# Altium schematic sheet 49. POWER INPUT.SchDoc: POWER INPUT
size 513 x 386 mm; Project: PROC154E2(001)_SK_AM69; Issue: 1.0; RevCode: E3; Page Create Date: March  8, 1995; Variant Name: Core Design; Schematic Page Number: 49; Page Number: 49; Page Size: C; Comment: MISTRAL_TITLEBLK_CSIZE_1; Page Count: 62; Schematic Page Count: 62; Name: PROC154E2 001 SK AM69; DsnPath: C:\Users\danie\Downloads\sprr466c\PROC154E3_RP\PROC154E3_SCH.DSN; SchematicName: SCHEMATIC1; PageName: 49. POWER INPUT; PageSize: C; TopSchematic: True
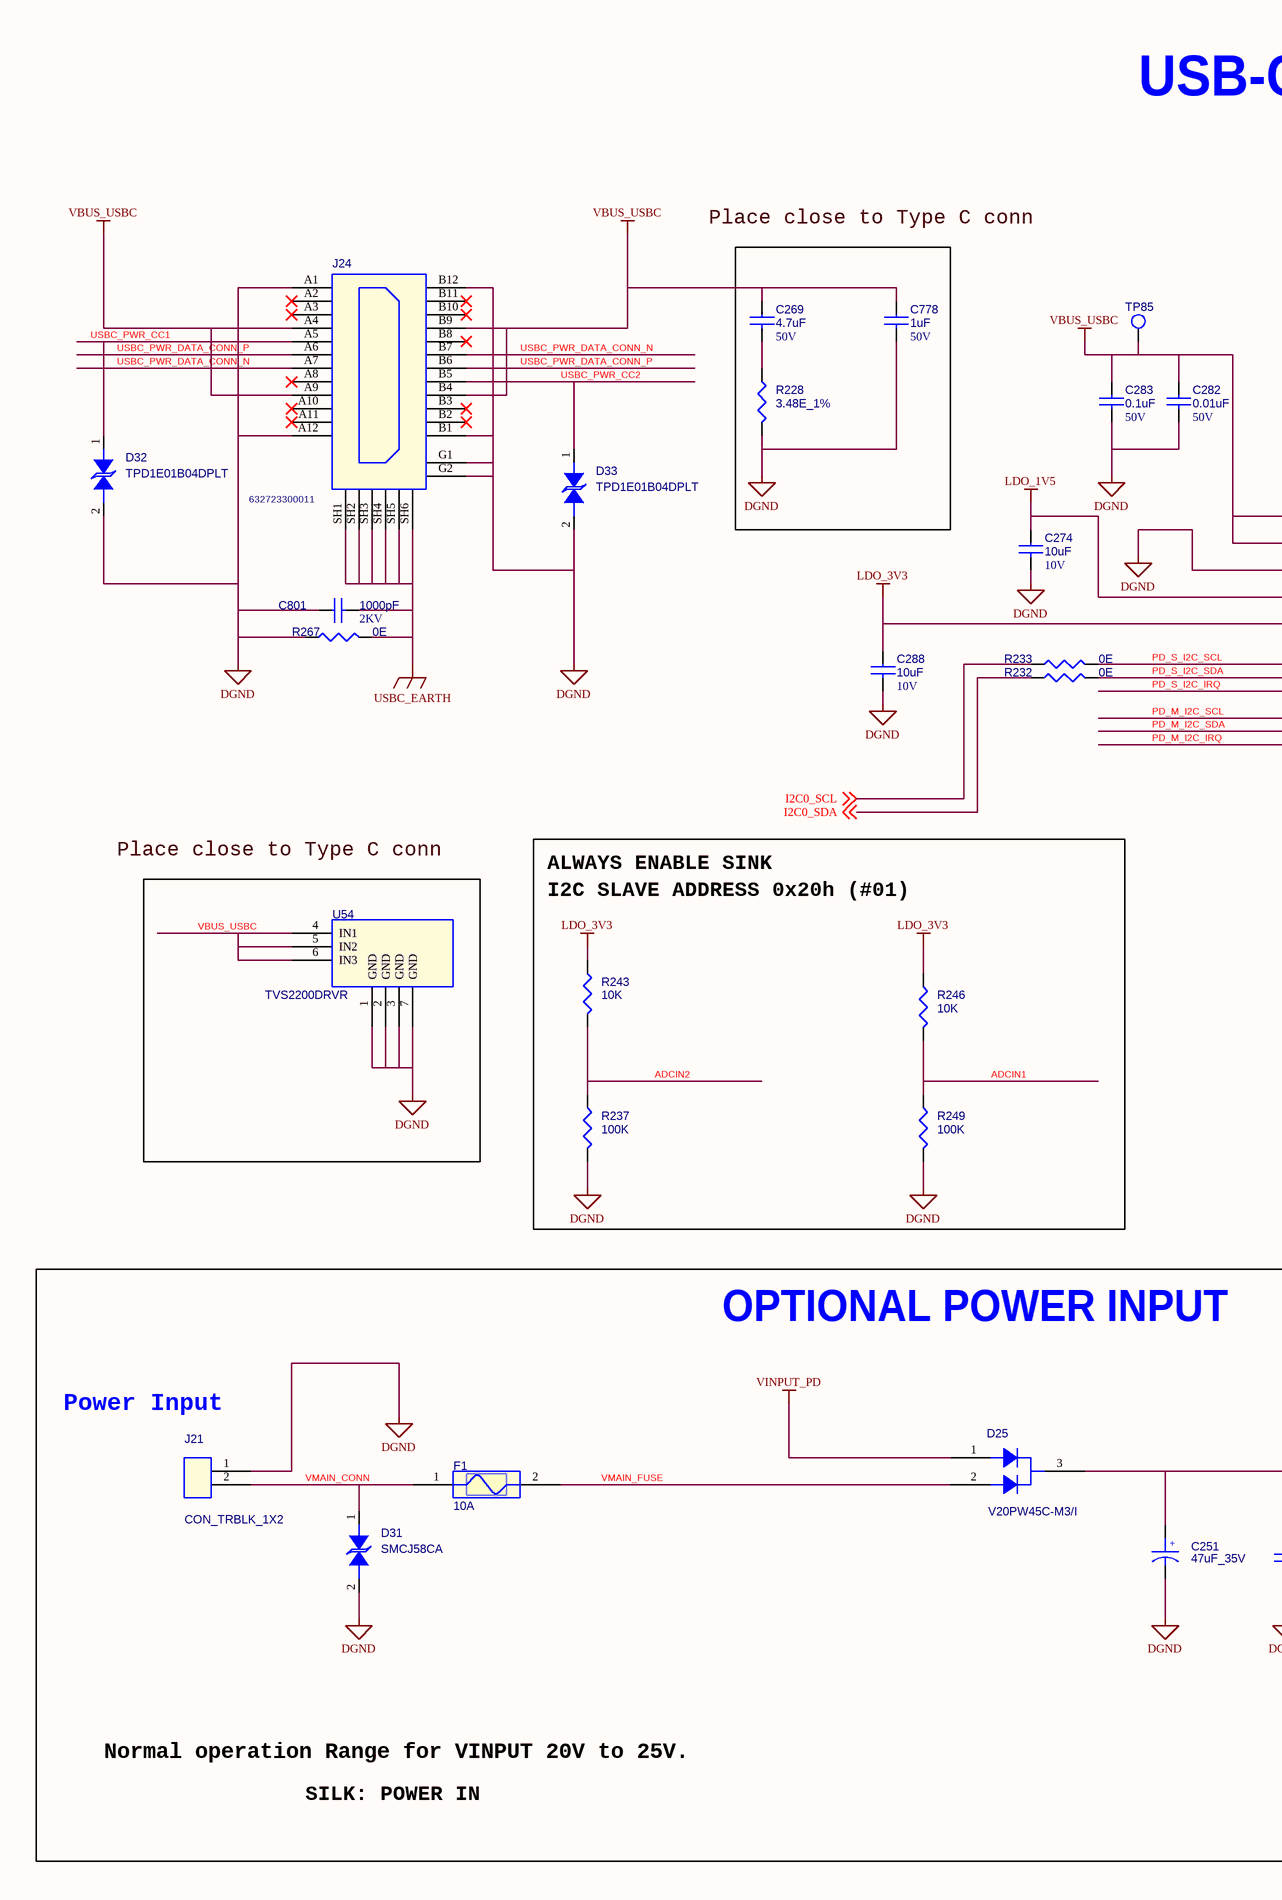
[diagram p0: 49. POWER INPUT.SchDoc, left]
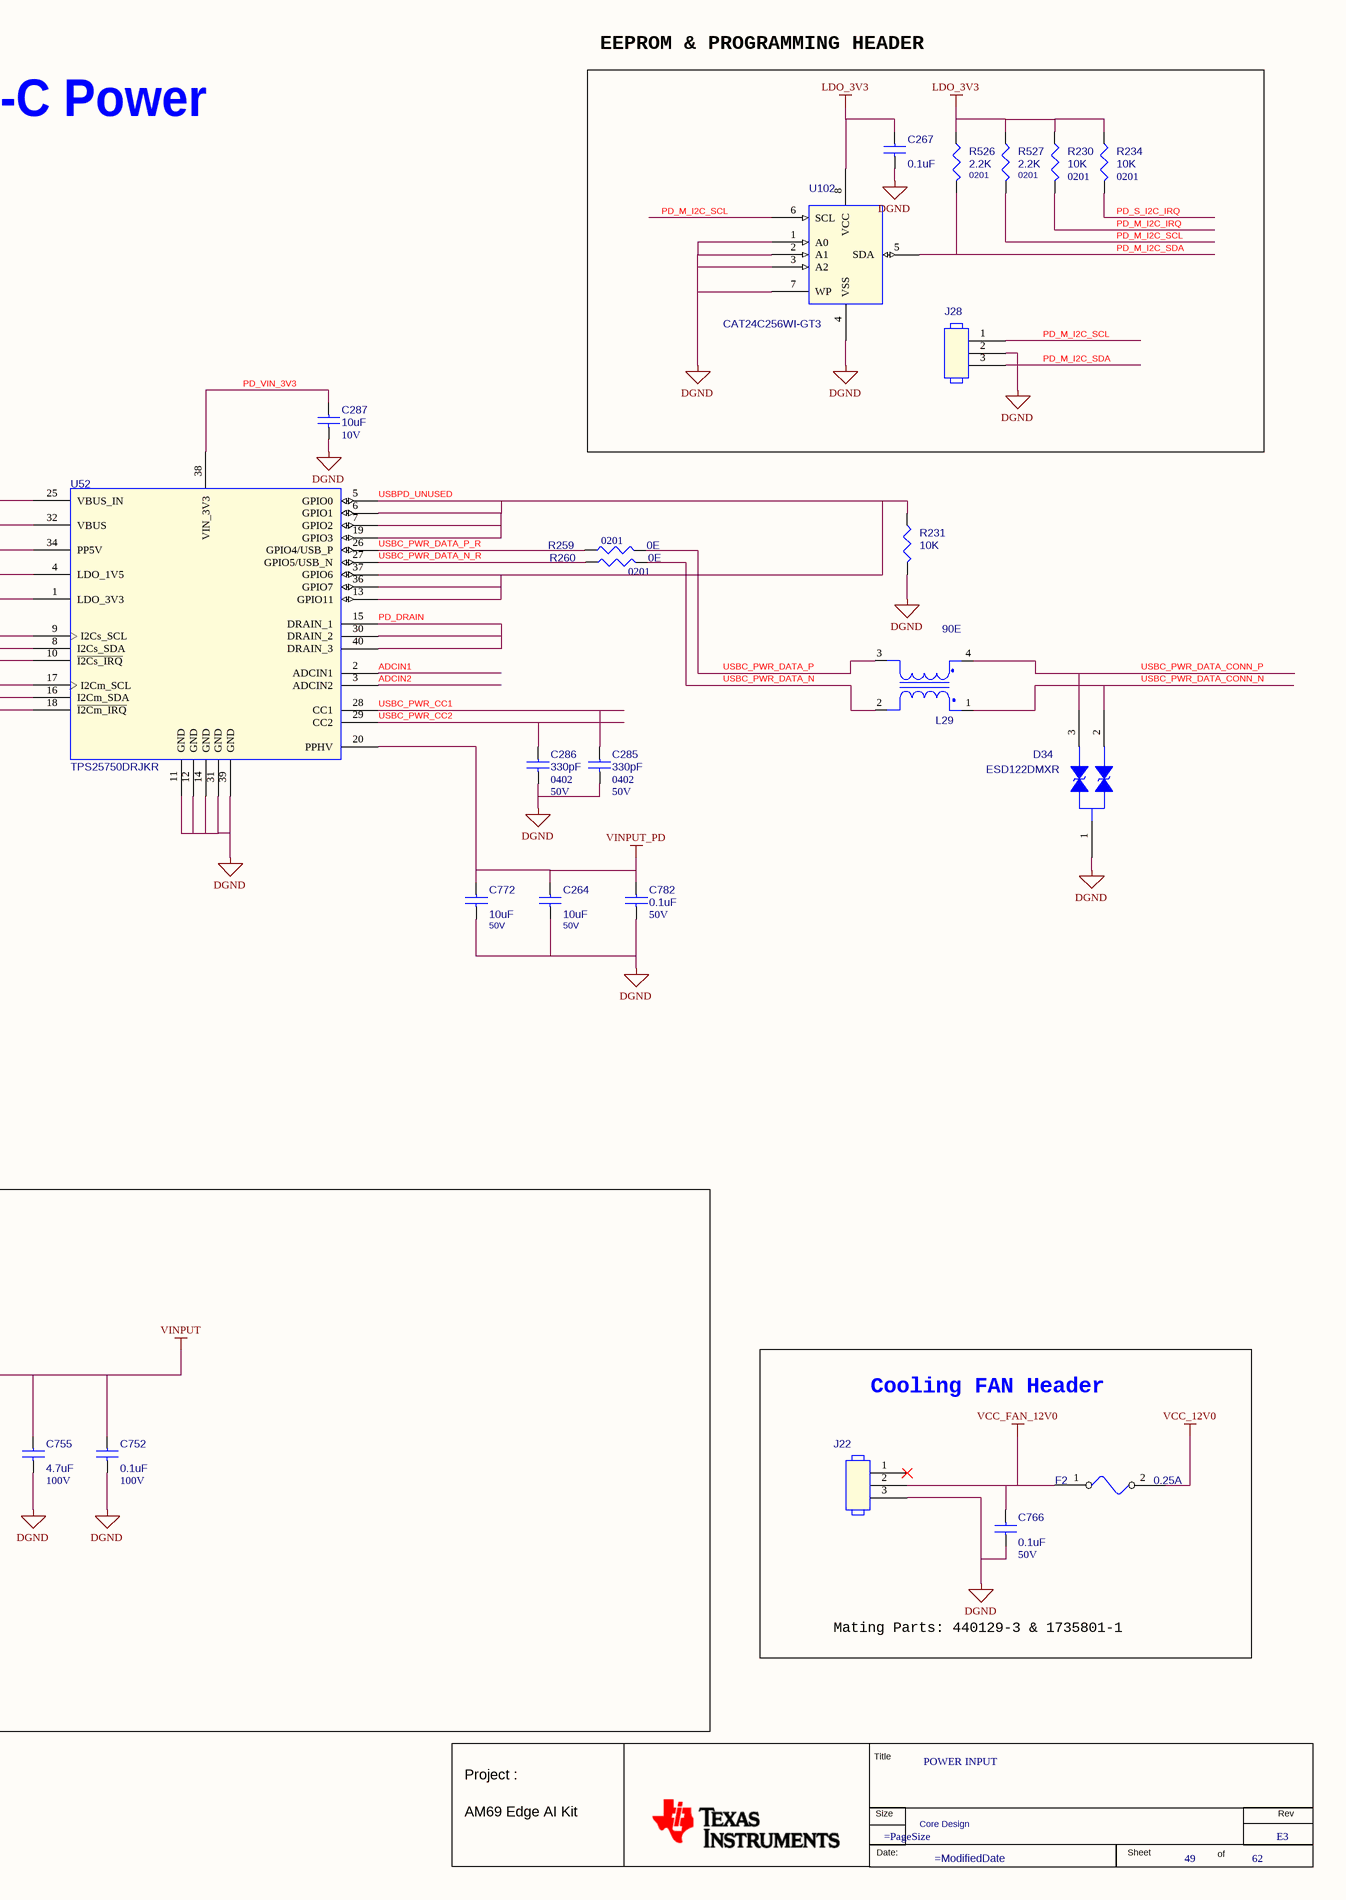
[diagram p1: 49. POWER INPUT.SchDoc, right]

## Parts
*  RevCode: E3  Title: POWER INPUT  Page Number: 49  Page Count: 62  Variant Name: Core Design  (hidden comment: MISTRAL_TITLEBLK_CSIZE_1)  (graphical)
C251  47uF_35V  [CAPT7343E_4-5]
C264  10uF  Voltage: 50V  [CAP1206_2]
C267  0.1uF  [CAP0201_0-5]
C269  4.7uF  Voltage: 50V  [CAP0805_1-5]
C274  10uF  Voltage: 10V  [CAP0402_1]
C282  0.01uF  Voltage: 50V  [CAP0402_0-75]
C283  0.1uF  Voltage: 50V  [CAP0402_0-75]
C285  330pF  Package: 0402  Voltage: 50V  [CAP0402_0-75]
C286  330pF  Voltage: 50V  Package: 0402  [CAP0402_0-75]
C287  10uF  Voltage: 10V  [CAP0402_1]
C288  10uF  Voltage: 10V  [CAP0402_1]
C752  0.1uF  Voltage: 100V  [CAP0603_1]
C755  4.7uF  Voltage: 100V  [CAP1210_2-25]
C766  0.1uF  Voltage: 50V  [CAP0402_0-75]
C772  10uF  Voltage: 50V  [CAP1206_2]
C778  1uF  Voltage: 50V  [CAP0805_1-5]
C782  0.1uF  Voltage: 50V  [CAP0402_0-75]
C801  1000pF  Voltage: 2KV  [CAP1206_1-5]
D25  V20PW45C-M3/I  [TO-252AE-3_V20PW45C_1-6]
D31  SMCJ58CA  [DIO_SMC_2-7]
D32  TPD1E01B04DPLT  [DIO_DFN0201_0-4]
D33  TPD1E01B04DPLT  [DIO_DFN0201_0-4]
D34  ESD122DMXR  [X2SON3_ESD122DMX_30X40_0-4]
F1  10A  [FUSEH_154004_380X200_SMD_3-9]
F2  0.25A  [FUSE_1206_0-8]
J21  CON_TRBLK_1X2  [CON_TB1X2_1803277_P_R_T_7-3]
J22  HDR_1X3  [HDR_1X3_440054-3_S_T_6-4]  (value not drawn)
J24  Mfr_part_number: 632723300011  [CON_USBC24_6327233_S_R_S_3-1]  (hidden comment: CON_USB-C_24_F)
J28  HDR_1X3  [HDR_1X3_100_S_T]  (value not drawn)
L29  90E  [IND4_DLW21H_90X60_SMD_1-4]
R228  3.48E_1%  [RES0402_0-5]
R230  10K  Package: 0201  [RES0201_0-5]
R231  10K  [RES0402_0-5]
R232  0E  [RES0402_0-5]
R233  0E  [RES0402_0-5]
R234  10K  Package: 0201  [RES0201_0-5]
R237  100K  [RES0402_0-5]
R243  10K  [RES0402_0-5]
R246  10K  [RES0402_0-5]
R249  100K  [RES0402_0-5]
R259  0E  Package: 0201  [RES0201_0-5]
R260  0E  Package: 0201  [RES0201_0-5]
R267  0E  [RES0805_0-75]
R526  2.2K  Package: 0201  [RES0201_0-5]
R527  2.2K  Package: 0201  [RES0201_0-5]
TP85  TP30_SMD  [TP30_SMD]  (value not drawn)
U52  TPS25750DRJKR  [WQFN38_TPS25750_240X160_0-8]
U54  TVS2200DRVR  [SON6_25-59_85X85_0-8]
U102  CAT24C256WI-GT3  [SOIC8_1-8]

## Blocks framed on the sheet
EEPROM & PROGRAMMING HEADER: C267 J28 R230 R234 R526 R527 U102
OPTIONAL POWER INPUT: C251 C752 C755 D25 D31 F1 J21
Cooling FAN Header: C766 F2 J22

## Nets
DGND: C251.2 C264.2 C267.2 C274.2 C282.2 C283.2 C285.2 C286.2 C287.2 C288.2 C752.2 C755.2 C766.1 C772.2 C778.2 C782.2 C801.1 D31.2(ANODE) D32.2(ANODE) D33.2(ANODE) D34.1(GND) J21.1 J22.3 J24.A1(GND) J24.A12(GND) J24.B1(GND) J24.B12(GND) J24.G1(GND) J24.G2(GND) J28.2 R228.2 R231.2 R237.2 R249.2 R267.1 U52.11(GND) U52.12(GND) U52.14(GND) U52.31(GND) U52.34(PP5V) U52.39(GND) U54.1(GND) U54.2(GND) U54.3(GND) U54.7(GND) U102.1(A0) U102.2(A1) U102.3(A2) U102.4(VSS) U102.7(WP)
LDO_1V5: C274.1 U52.4(LDO_1V5)
LDO_3V3: C267.1 C288.1 R230.1 R234.1 R243.1 R246.1 R526.1 R527.1 U52.1(LDO_3V3) U102.8(VCC)
USBC_EARTH: C801.2 J24.SH1 J24.SH2 J24.SH3 J24.SH4 J24.SH5 J24.SH6 R267.2
VBUS_USBC: C269.1 C282.1 C283.1 C778.1 J24.A4(VBUS1) J24.A9(VBUS2) J24.B4(VBUS3) J24.B9(VBUS4) TP85.1(TP) U52.25(VBUS_IN) U52.32(VBUS) U54.4(IN1) U54.5(IN2) U54.6(IN3)
VCC_12V0: F2.2
VCC_FAN_12V0: C766.2 F2.1 J22.2
VINPUT: C251.1 C752.1 C755.1 D25.3(K)
VINPUT_PD: C264.1 C772.1 C782.1 D25.1 U52.20(PPHV)
ADCIN1: R246.2 R249.1 U52.2(ADCIN1)
ADCIN2: R237.1 R243.2 U52.3(ADCIN2)
I2C0_SCL: R233.1 ; off-sheet I2C0_SCL
I2C0_SDA: R232.1 ; off-sheet I2C0_SDA
PD_DRAIN: U52.15(DRAIN_1) U52.30(DRAIN_2) U52.40(DRAIN_3)
PD_M_I2C_IRQ: R230.2 U52.18(~{I2Cm_IRQ})
PD_M_I2C_SCL: J28.1 R527.2 U52.17(I2Cm_SCL) U102.6(SCL)
PD_M_I2C_SDA: J28.3 R526.2 U52.16(I2Cm_SDA) U102.5(SDA)
PD_S_I2C_IRQ: R234.2 U52.10(~{I2Cs_IRQ})
PD_S_I2C_SCL: R233.2 U52.9(I2Cs_SCL)
PD_S_I2C_SDA: R232.2 U52.8(I2Cs_SDA)
PD_VIN_3V3: C287.1 U52.38(VIN_3V3)
USBC_PWR_CC1: C285.1 D32.1(CATHODE) J24.A5(CC1) U52.28(CC1)
USBC_PWR_CC2: C286.1 D33.1(CATHODE) J24.B5(CC2) U52.29(CC2)
USBC_PWR_DATA_CONN_N: D34.2(IO1) J24.A7(DN1) J24.B7(DN2) L29.1(IN1)
USBC_PWR_DATA_CONN_P: D34.3(IO2) J24.A6(DP1) J24.B6(DP2) L29.4(OUT2)
USBC_PWR_DATA_N: L29.2(IN2) R260.2
USBC_PWR_DATA_N_R: R260.1 U52.27(GPIO5/USB_N)
USBC_PWR_DATA_P: L29.3(OUT1) R259.2
USBC_PWR_DATA_P_R: R259.1 U52.26(GPIO4/USB_P)
USBPD_UNUSED: R231.1 U52.5(GPIO0) U52.6(GPIO1) U52.7(GPIO2) U52.13(GPIO11) U52.19(GPIO3) U52.36(GPIO7) U52.37(GPIO6)
VMAIN_CONN: D31.1(CATHODE) F1.1 J21.2
VMAIN_FUSE: D25.2 F1.2
NetC269_2: C269.2 R228.1

Not connected (* = marked no-connect by the designer): J22 1*; J24 A2(SSTXP1)* A3(SSTXN1)* A8(SBU1)* A10(SSRXN2)* A11(SSRXP2)* B2(SSTXP2)* B3(SSTXN2)* B8(SBU2)* B10(SSRXN1)* B11(SSRXP1)*

## Notes on the sheet
- USB-C Power
- Place close to Type C conn
- ALWAYS ENABLE SINK
- I2C SLAVE ADDRESS 0x20h (#01)
- Power Input
- Normal operation Range for VINPUT 20V to 25V.
- SILK: POWER IN
- Mating Parts: 440129-3 & 1735801-1
- (in symbol CAP_POL) +
- (in symbol MISTRAL_TITLEBLK_CSIZE_1) Title; Project :; Size; Rev; AM69 Edge AI Kit; Date:; Sheet; of

## Library data of the parts
* = MISTRAL_TITLEBLK_CSIZE_1: Issue: 1.0; Project: PROC154E2(001)_SK_AM69; Name: PROC154E2 001 SK AM69; Page Create Date: March  8, 1995; Page Size: =PageSize; Page Modify Date: =ModifiedDate; Schematic Page Count: 62; Schematic Page Number: 49
C251 = CAP_POL: CAP TANTALUM 47uF 35V 20% ESR 0.9E E7343; Part Reference: C251; Mistral Part No: 120009030743-R; Mfr_name: AVX CORPORATION; Mfr_part_number: TAJE476M035R; Part_type: CAPACITORS\TANTALUM; Project: LTS; Wattage: NA; Customs_HS_Code: 85322990; Custom_Duty: 15%; Value: 47uF_35V; PCB Footprint: CAPT7343E_4-5; Footprint Ref: CAPT7343E_4-5; Tolerance: 20%; Voltage: 35V; Package: E7343; Distributor_name: DIGIKEY; Distributor_part_number: 478-3958-1-ND; Library Ref: CAP_POL; Height: 4.30MM; Weight: 670mg; Temperature: -55°C+125°C; Datasheet: Y:\MIS_DATABASE\DATASHEETS\CAPACITORS\AVX-TAJ-SER.PDF; Crtd /date: MAZHAR/211206; Chkd/date: SHREESHAIL/300507; MECHANICAL 3D STEP FILE: CAPT7343E_4-5; Library Path: Y:\MIS_DATABASE\Library\ALTIUM_TOOL\SCHEMATICS_PARTS\MS_DISCRETE_Library.schlib; Footprint Path: Y:\MIS_DATABASE\Library\ALTIUM_TOOL\PCB_FOOTPRINTS\Altium_Footprint_Lib.PcbLib
C264 = CAP_Dup1: CAP CERAMIC 10uF 50V 10% X5R AUTO 1206; Part Reference: C264; Part_type: CAPACITORS\CERAMIC; Mfr_part_number: GRT31CR61H106KE01L; Mfr_name: MURATA; Mistral Part No: 120011060019-R; Custom_Duty: 15%; Customs_HS_Code: 85322990; Wattage: NA; Project: LRDE_ABCMV2_MB; Value: 10uF; Footprint Path: Y:\MIS_DATABASE\Library\ALTIUM_TOOL\PCB_FOOTPRINTS\Altium_Footprint_Lib.PcbLib; Library Path: Y:\MIS_DATABASE\Library\ALTIUM_TOOL\SCHEMATICS_PARTS\MS_DISCRETE_Library.schlib; MECHANICAL 3D STEP FILE: CAP1206_2; Chkd/date: MANIRAJA/261018; Crtd /date: ALVY/261018; Datasheet: Y:\MIS_DATABASE\DATASHEETS\CAPACITORS\GRT31CR61H106KE01L.PDF; Temperature: -55°C+85°C; Weight: 16.2mg; Height: 1.80MM; Library Ref: CAP; Distributor_part_number: 490-12456-1-ND; Distributor_name: DIGIKEY; Package: 1206; Tolerance: 10%; Footprint Ref: CAP1206_2; PCB Footprint: CAP1206_2
C267 = CAP_Dup1: CAP CERAMIC 0.1uF 16V 10% X7S AUTO 0201; Part Reference: C267; Mistral Part No: 120021030007-R; Mfr_name: MURATA; Mfr_part_number: GRT033C71C104KE01D; Part_type: CAPACITORS\CERAMIC; Project: J7ES_SK_BRD; Wattage: NA; Customs_HS_Code: 85322990; Custom_Duty: 15%; Value: 0.1uF; PCB Footprint: CAP0201_0-5; Tolerance: 10%; Voltage: 16V; Package: 0201; Distributor_name: DIGIKEY; Distributor_part_number: 490-GRT033C71C104KE01DTR-ND; Height: 0.33MM; Weight: 330mg; Temperature: -55°C+125°C; Datasheet: Y:\MIS_DATABASE\DATASHEETS\CAPACITORS\GRT033C71C104KE01.PDF; Crtd /date: ALVY/110321; Chkd/date: MANIRAJA/110321; MECHANICAL 3D STEP FILE: CAP0201_0-5
C269 = CAP_Dup1: CAP CERAMIC 4.7uF 50V 10% X5R AUTO 0805; Part Reference: C269; Mistral Part No: 120021020034-R; Mfr_name: MURATA; Mfr_part_number: GRT21BR61H475KE13L; Part_type: CAPACITORS\CERAMIC; Project: TI_DRA821 SK EVM BRD; Wattage: NA; Customs_HS_Code: 85322990; Custom_Duty: 15%; Value: 4.7uF; Footprint Ref: CAP0805_1-5; Tolerance: 10%; Package: 0805; Distributor_name: DIGIKEY; Distributor_part_number: 490-12394-1-ND; Library Ref: CAP; Height: 1.40MM; Weight: 5.5mg; Temperature: -55°C+85°C; Datasheet: Y:\MIS_DATABASE\DATASHEETS\CAPACITORS\GRT21BR61H475KE13.PDF; Crtd /date: ALVY/240221; Chkd/date: MANIRAJA/250221; MECHANICAL 3D STEP FILE: CAP0805_1-5; Library Path: Y:\MIS_DATABASE\Library\ALTIUM_TOOL\SCHEMATICS_PARTS\MS_DISCRETE_Library.schlib; Footprint Path: Y:\MIS_DATABASE\Library\ALTIUM_TOOL\PCB_FOOTPRINTS\Altium_Footprint_Lib.PcbLib; PCB Footprint: CAP0805_1-5
C274 = CAP_Dup1: CAP CERAMIC 10uF 10V 20% X5R 0402; Part Reference: C274; Part_type: CAPACITORS\CERAMIC; Mfr_part_number: CL05A106MP8NUB8; Mfr_name: SAMSUNG; Mistral Part No: 120019020008-R; Wattage: NA; Custom_Duty: 15%; Customs_HS_Code: 85322990; Project: TI_60GHz-AOP; Value: 10uF; MECHANICAL 3D STEP FILE: CAP0402_1; Temperature: -55°C+85°C; Weight: NA; Chkd/date: MANIRAJA/150219; Crtd /date: ALVY/150219; Datasheet: Y:\MIS_DATABASE\DATASHEETS\CAPACITORS\CL05A106MP8NUB8.PDF; Height: 0.90MM; Library Ref: CAP; Distributor_part_number: 1276-6830-1-ND; Distributor_name: DIGIKEY; Package: 0402; Tolerance: 20%; Footprint Ref: CAP0402_1; Library Path: Y:\MIS_DATABASE\Library\ALTIUM_TOOL\SCHEMATICS_PARTS\MS_DISCRETE_Library.schlib; Footprint Path: Y:\MIS_DATABASE\Library\ALTIUM_TOOL\PCB_FOOTPRINTS\Altium_Footprint_Lib.PcbLib; PCB Footprint: CAP0402_1
C282 = CAP_Dup1: CAP CERAMIC 0.01uF 50V 10% X7R AUTO 0402; Part Reference: C282; Mistral Part No: 120019040011-R; Mfr_name: MURATA; Mfr_part_number: GRT155R71H103KE01D; Part_type: CAPACITORS\CERAMIC; Project: TI_DRA821 SK EVM BRD; Wattage: NA; Customs_HS_Code: 85322990; Custom_Duty: 15%; Value: 0.01uF; Footprint Ref: CAP0402_0-75; Tolerance: 10%; Package: 0402; Distributor_name: MOUSER; Distributor_part_number: 81-GRT155R71H103KE1D; Library Ref: CAP; Height: 0.55MM; Weight: 1.6mg; Temperature: -55°C+125°C; Datasheet: Y:\MIS_DATABASE\DATASHEETS\CAPACITORS\GRT155R71H103KE01.PDF; Crtd /date: ALVY/240221; Chkd/date: MANIRAJA/250221; MECHANICAL 3D STEP FILE: CAP0402_0-75; Library Path: Y:\MIS_DATABASE\Library\ALTIUM_TOOL\SCHEMATICS_PARTS\MS_DISCRETE_Library.schlib; Footprint Path: Y:\MIS_DATABASE\Library\ALTIUM_TOOL\PCB_FOOTPRINTS\Altium_Footprint_Lib.PcbLib; PCB Footprint: CAP0402_0-75
C283 = CAP_Dup1: CAP CERAMIC 0.1uF 50V 10% X7R AUTO 0402; Part Reference: C283; Part_type: CAPACITORS\CERAMIC; Mfr_part_number: GRT155R71H104KE01D; Mfr_name: MURATA; Mistral Part No: 120019030005-R; Custom_Duty: 15%; Customs_HS_Code: 85322990; Wattage: NA; Project: TI_DRA821 SK EVM BRD; Value: 0.1uF; MECHANICAL 3D STEP FILE: CAP0402_0-75; Footprint Path: Y:\MIS_DATABASE\Library\ALTIUM_TOOL\PCB_FOOTPRINTS\Altium_Footprint_Lib.PcbLib; Library Path: Y:\MIS_DATABASE\Library\ALTIUM_TOOL\SCHEMATICS_PARTS\MS_DISCRETE_Library.schlib; Chkd/date: MANIRAJA/250221; Crtd /date: ALVY/240221; Datasheet: Y:\MIS_DATABASE\DATASHEETS\CAPACITORS\GRT155R71H104KE01.PDF; Temperature: -55°C+125°C; Weight: NA; Height: 0.55MM; Library Ref: CAP; Distributor_part_number: 81-GRT155R71H104KE1D; Distributor_name: MOUSER; Package: 0402; Tolerance: 10%; Footprint Ref: CAP0402_0-75; PCB Footprint: CAP0402_0-75
C285 = CAP_Dup1: CAP CERAMIC 330pF 50V 5% C0G(NP0) AUTO 0402; Part Reference: C285; Part_type: CAPACITORS\CERAMIC; Mfr_part_number: GRT1555C1H331JA02D; Mfr_name: MURATA; Mistral Part No: 120019050019-R; Custom_Duty: 15%; Customs_HS_Code: 85322990; Wattage: NA; Project: TI_DRA821 SK EVM BRD; Value: 330pF; Footprint Path: Y:\MIS_DATABASE\Library\ALTIUM_TOOL\PCB_FOOTPRINTS\Altium_Footprint_Lib.PcbLib; Library Path: Y:\MIS_DATABASE\Library\ALTIUM_TOOL\SCHEMATICS_PARTS\MS_DISCRETE_Library.schlib; MECHANICAL 3D STEP FILE: CAP0402_0-75; Chkd/date: MANIRAJA/250221; Crtd /date: ALVY/240221; Datasheet: Y:\MIS_DATABASE\DATASHEETS\CAPACITORS\GRT1555C1H331JA02.PDF; Temperature: -55°C+125°C; Weight: 3.1mg; Height: 0.55MM; Footprint Ref: CAP0402_0-75; Library Ref: CAP; Distributor_part_number: 81-GRT1555C1H331JA2D; Distributor_name: MOUSER; Tolerance: 5%; PCB Footprint: CAP0402_0-75
C286 = CAP_Dup1: CAP CERAMIC 330pF 50V 5% C0G(NP0) AUTO 0402; Part Reference: C286; Mistral Part No: 120019050019-R; Mfr_name: MURATA; Mfr_part_number: GRT1555C1H331JA02D; Part_type: CAPACITORS\CERAMIC; Project: TI_DRA821 SK EVM BRD; Wattage: NA; Customs_HS_Code: 85322990; Custom_Duty: 15%; Value: 330pF; Tolerance: 5%; Distributor_name: MOUSER; Distributor_part_number: 81-GRT1555C1H331JA2D; Library Ref: CAP; Footprint Ref: CAP0402_0-75; Height: 0.55MM; Weight: 3.1mg; Temperature: -55°C+125°C; Datasheet: Y:\MIS_DATABASE\DATASHEETS\CAPACITORS\GRT1555C1H331JA02.PDF; Crtd /date: ALVY/240221; Chkd/date: MANIRAJA/250221; MECHANICAL 3D STEP FILE: CAP0402_0-75; Library Path: Y:\MIS_DATABASE\Library\ALTIUM_TOOL\SCHEMATICS_PARTS\MS_DISCRETE_Library.schlib; Footprint Path: Y:\MIS_DATABASE\Library\ALTIUM_TOOL\PCB_FOOTPRINTS\Altium_Footprint_Lib.PcbLib; PCB Footprint: CAP0402_0-75
C287 = CAP_Dup1: CAP CERAMIC 10uF 10V 20% X5R 0402; Part Reference: C287; Part_type: CAPACITORS\CERAMIC; Mfr_part_number: CL05A106MP8NUB8; Mfr_name: SAMSUNG; Mistral Part No: 120019020008-R; Custom_Duty: 15%; Customs_HS_Code: 85322990; Wattage: NA; Project: TI_60GHz-AOP; Value: 10uF; MECHANICAL 3D STEP FILE: CAP0402_1; Footprint Path: Y:\MIS_DATABASE\Library\ALTIUM_TOOL\PCB_FOOTPRINTS\Altium_Footprint_Lib.PcbLib; Library Path: Y:\MIS_DATABASE\Library\ALTIUM_TOOL\SCHEMATICS_PARTS\MS_DISCRETE_Library.schlib; Chkd/date: MANIRAJA/150219; Crtd /date: ALVY/150219; Datasheet: Y:\MIS_DATABASE\DATASHEETS\CAPACITORS\CL05A106MP8NUB8.PDF; Temperature: -55°C+85°C; Weight: NA; Height: 0.90MM; Library Ref: CAP; Distributor_part_number: 1276-6830-1-ND; Distributor_name: DIGIKEY; Package: 0402; Tolerance: 20%; Footprint Ref: CAP0402_1; PCB Footprint: CAP0402_1
C288 = CAP_Dup1: CAP CERAMIC 10uF 10V 20% X5R 0402; Part Reference: C288; Mistral Part No: 120019020008-R; Mfr_name: SAMSUNG; Mfr_part_number: CL05A106MP8NUB8; Part_type: CAPACITORS\CERAMIC; Project: TI_60GHz-AOP; Customs_HS_Code: 85322990; Custom_Duty: 15%; Wattage: NA; Value: 10uF; Footprint Path: Y:\MIS_DATABASE\Library\ALTIUM_TOOL\PCB_FOOTPRINTS\Altium_Footprint_Lib.PcbLib; Library Path: Y:\MIS_DATABASE\Library\ALTIUM_TOOL\SCHEMATICS_PARTS\MS_DISCRETE_Library.schlib; Footprint Ref: CAP0402_1; Tolerance: 20%; Package: 0402; Distributor_name: DIGIKEY; Distributor_part_number: 1276-6830-1-ND; Library Ref: CAP; Height: 0.90MM; Datasheet: Y:\MIS_DATABASE\DATASHEETS\CAPACITORS\CL05A106MP8NUB8.PDF; Crtd /date: ALVY/150219; Chkd/date: MANIRAJA/150219; Weight: NA; Temperature: -55°C+85°C; MECHANICAL 3D STEP FILE: CAP0402_1; PCB Footprint: CAP0402_1
C752 = CAP: CAP CERAMIC 0.1uF 100V 10% X7R 0603; Part Reference: C752; Manufacturer: MURATA; Mfr_part_number: GRM188R72A104KA35D; Mistral Part No: 120017010012-R; Mistral part number: NSPN00374; Mfr: YAGEO AMERICA; MfrNum: CC0603KRX7R0BB104; Part_type: CAPACITORS\CERAMIC; Direct Alternate_mfr_name: SAMSUNG; Direct Alternate_mfr_part_number: CL10B104JB8NNNC; Automotive Alternate_mfr_name: TDK; Automotive Alternate_mfr_part_number: CGA3E2X7R1H104K080AA; Custom_Duty: 15%; Customs_HS_Code: 85322990; Wattage: NA; Project: CUSTOM DCA1000; Value: 0.1uF; PCB Footprint: CAP0603_1; Footprint Path: Y:\MIS_DATABASE\Library\ALTIUM_TOOL\PCB_FOOTPRINTS\Altium_Footprint_Lib.PcbLib; Library Path: Y:\MIS_DATABASE\Library\ALTIUM_TOOL\SCHEMATICS_PARTS\MS_DISCRETE_Library.schlib; Footprint Ref: CAP0603_1; Library Ref: CAP; MECHANICAL 3D STEP FILE: CAP0603_1; Chkd/date: MANIRAJA/170420; Datasheet: Y:\MIS_DATABASE\DATASHEETS\CAPACITORS\GRM188R72A104KA35.PDF; Temperature: -55°C+125°C; Weight: 6.3mg; Height: 0.90MM; Distributor_part_number: 490-3285-1-ND; Distributor_name: DIGIKEY; Package: 0603; Tolerance: 10%; Mfr_name: MURATA; DescriptiveText: CAP CERAMIC 0.1uF 100V 10% X7R 0603; Crtd /date: ALVY/170420
C755 = CAP_Dup1: CAP CERAMIC 4.7uF 100V 10% X7S AUTO 1210; Part Reference: C755; Manufacturer: MURATA; Mistral Part No: 120022090024-R; Mfr_part_number: GCM32DC72A475KE02; Part_type: CAPACITORS\CERAMIC; Direct Alternate_mfr_part_number: GRM21BR61H475KE51L; Automotive Alternate_mfr_name: TDK; Automotive Alternate_mfr_part_number: CGA4J1X7R1H475K125AC; Project: J7AHP_SK_BRD; Wattage: NA; Customs_HS_Code: 85322990; Custom_Duty: 15%; Value: 4.7uF; PCB Footprint: CAP1210_2-25; Mfr_name: MURATA; Tolerance: 10%; Package: 1210; Distributor_name: DIGIKEY; Distributor_part_number: 490-GCM32DC72A475KE02KCT-ND; Library Ref: CAP; Height: 2.20MM; Weight: 95mg; Temperature: -55°C+125°C; Datasheet: Y:\MIS_DATABASE\DATASHEETS\CAPACITORS\GCM32DC72A475KE02.PDF; Crtd /date: PRAVEEN/160922; Chkd/date: PRAVEEN/160922; MECHANICAL 3D STEP FILE: CAP1210_2-25; Footprint Ref: CAP1210_2-25; Library Path: Y:\MIS_DATABASE\Library\ALTIUM_TOOL\SCHEMATICS_PARTS\MS_DISCRETE_Library.schlib; Footprint Path: Y:\MIS_DATABASE\Library\ALTIUM_TOOL\PCB_FOOTPRINTS\Altium_Footprint_Lib.PcbLib; Direct Alternate_mfr_name: MURATA
C766 = CAP_Dup1: CAP CERAMIC 0.1uF 50V 10% X7R 0402; Part Reference: C766; Part_type: CAPACITORS\CERAMIC; Mfr_part_number: GRM155R71H104KE14D; Mfr_name: MURATA; Mistral Part No: 120011100014-R; Direct Alternate_mfr_name: TDK; Direct Alternate_mfr_part_number: C1005X7R1H104K050BE; Automotive Alternate_mfr_part_number: CGA2B3X7R1H104K050BB; Custom_Duty: 15%; Customs_HS_Code: 85322990; Wattage: NA; Project: J7_CP; Value: 0.1uF; PCB Footprint: CAP0402_0-75; Footprint Path: Y:\MIS_DATABASE\Library\ALTIUM_TOOL\PCB_FOOTPRINTS\Altium_Footprint_Lib.PcbLib; Library Path: Y:\MIS_DATABASE\Library\ALTIUM_TOOL\SCHEMATICS_PARTS\MS_DISCRETE_Library.schlib; MECHANICAL 3D STEP FILE: CAP0402_0-75; Chkd/date: MANIRAJA/261020; Crtd /date: ALVY/211020; Datasheet: Y:\MIS_DATABASE\DATASHEETS\CAPACITORS\GRM155R71H104KE14.PDF; Temperature: -55°C+125°C; Weight: 3.1mg; Height: 0.55MM; Distributor_part_number: 490-10700-1-ND; Distributor_name: DIGIKEY; Package: 0402; Tolerance: 10%; Library Ref: CAP; Footprint Ref: CAP0402_0-75; Automotive Alternate_mfr_name: TDK; Manufacturer: MURATA
C772 = CAP_Dup1: CAP CERAMIC 10uF 50V 10% X5R AUTO 1206; Part Reference: C772; Direct Alternate_mfr_part_number: C3216X5R1E476M160AC; Direct Alternate_mfr_name: TDK; Part_type: CAPACITORS\CERAMIC; Mfr_part_number: GRT31CR61H106KE01L; Mfr_name: MURATA; Mistral Part No: 120011060019-R; Custom_Duty: 15%; Customs_HS_Code: 85322990; Wattage: NA; Project: LRDE_ABCMV2_MB; Value: 10uF; Footprint Path: Y:\MIS_DATABASE\Library\ALTIUM_TOOL\PCB_FOOTPRINTS\Altium_Footprint_Lib.PcbLib; Library Path: Y:\MIS_DATABASE\Library\ALTIUM_TOOL\SCHEMATICS_PARTS\MS_DISCRETE_Library.schlib; MECHANICAL 3D STEP FILE: CAP1206_2; Chkd/date: MANIRAJA/261018; Crtd /date: ALVY/261018; Datasheet: Y:\MIS_DATABASE\DATASHEETS\CAPACITORS\GRT31CR61H106KE01L.PDF; Temperature: -55°C+85°C; Weight: 16.2mg; Height: 1.80MM; Library Ref: CAP; Distributor_part_number: 490-12456-1-ND; Distributor_name: DIGIKEY; Package: 1206; Tolerance: 10%; Footprint Ref: CAP1206_2; PCB Footprint: CAP1206_2
C778 = CAP_Dup1: CAP CERAMIC 1uF 50V 10% X7R AUTO 0805; Part Reference: C778; Mistral Part No: 120021020035-R; Mfr_name: MURATA; Mfr_part_number: GRT21BR71H105KE01L; Part_type: CAPACITORS\CERAMIC; Project: TI_DRA821 SK EVM BRD; Wattage: NA; Customs_HS_Code: 85322990; Custom_Duty: 15%; Value: 1uF; Footprint Ref: CAP0805_1-5; Tolerance: 10%; Package: 0805; Distributor_name: MOUSER; Distributor_part_number: 81-GRT21BR71H105KE1L; Library Ref: CAP; Height: 1.35MM; Weight: 17mg; Temperature: -55°C+125°C; Datasheet: Y:\MIS_DATABASE\DATASHEETS\CAPACITORS\GRT21BR71H105KE01.PDF; Crtd /date: ALVY/240221; Chkd/date: MANIRAJA/250221; MECHANICAL 3D STEP FILE: CAP0805_1-5; Library Path: Y:\MIS_DATABASE\Library\ALTIUM_TOOL\SCHEMATICS_PARTS\MS_DISCRETE_Library.schlib; Footprint Path: Y:\MIS_DATABASE\Library\ALTIUM_TOOL\PCB_FOOTPRINTS\Altium_Footprint_Lib.PcbLib; PCB Footprint: CAP0805_1-5
C782 = CAP_Dup1: CAP CERAMIC 0.1uF 50V 10% X7R AUTO 0402; Part Reference: C782; Part_type: CAPACITORS\CERAMIC; Mfr_part_number: GRT155R71H104KE01D; Mfr_name: MURATA; Mistral Part No: 120019030005-R; Custom_Duty: 15%; Customs_HS_Code: 85322990; Wattage: NA; Project: TI_DRA821 SK EVM BRD; Value: 0.1uF; MECHANICAL 3D STEP FILE: CAP0402_0-75; Footprint Path: Y:\MIS_DATABASE\Library\ALTIUM_TOOL\PCB_FOOTPRINTS\Altium_Footprint_Lib.PcbLib; Library Path: Y:\MIS_DATABASE\Library\ALTIUM_TOOL\SCHEMATICS_PARTS\MS_DISCRETE_Library.schlib; Chkd/date: MANIRAJA/250221; Crtd /date: ALVY/240221; Datasheet: Y:\MIS_DATABASE\DATASHEETS\CAPACITORS\GRT155R71H104KE01.PDF; Temperature: -55°C+125°C; Weight: NA; Height: 0.55MM; Library Ref: CAP; Distributor_part_number: 81-GRT155R71H104KE1D; Distributor_name: MOUSER; Package: 0402; Tolerance: 10%; Footprint Ref: CAP0402_0-75; PCB Footprint: CAP0402_0-75
C801 = CAP_Dup1: CAP CERAMIC 1000pF 2KV 10% X7R 1206; Part Reference: C801; Mistral Part No: 120015110005-R; Mfr_name: KEMET; Mfr_part_number: C1206C102KGRACTU; Part_type: CAPACITORS\CERAMIC; Automotive Alternate_mfr_part_number: C1206X102KGRACAUTO; Project: MANTIS_1.0_BRD; Customs_HS_Code: 85322990; Custom_Duty: 15%; Wattage: NA; Value: 1000pF; Footprint Path: Y:\MIS_DATABASE\Library\ALTIUM_TOOL\PCB_FOOTPRINTS\Altium_Footprint_Lib.PcbLib; Library Path: Y:\MIS_DATABASE\Library\ALTIUM_TOOL\SCHEMATICS_PARTS\MS_DISCRETE_Library.schlib; Footprint Ref: CAP1206_1-5; Library Ref: CAP; Tolerance: 10%; Package: 1206; Distributor_name: DIGIKEY; Distributor_part_number: 399-4819-1-ND; Height: 1.35MM; Weight: 16.2mg; Temperature: -55°C+125°C; Datasheet: Y:\MIS_DATABASE\DATASHEETS\CAPACITORS\KEMET-C-X7R-HV.PDF; Crtd /date: ALVY/111219; Chkd/date: MANIRAJA/111219; MECHANICAL 3D STEP FILE: CAP1206_1-5; Direct Alternate_mfr_name: KEMET; Direct Alternate_mfr_part_number: C1206C102KGRACTU; Automotive Alternate_mfr_name: KEMET; PCB Footprint: CAP1206_1-5
D25 = DIODE_V20PW45C: DIODE SCHOTTKY TMBS RECTIFIER 45V 10A TO-252AE-3; Part Reference: D25; Part_type: DIODE\SCHOTTKY; Mfr_name: VISHAY; Mistral Part No: 130019040014-R; Custom_Duty: 15%; Customs_HS_Code: 85412900; Wattage: NA; Project: TI_J7ES_EVM_FUSION2_SER_CAP; Value: V20PW45C-M3/I; PCB Footprint: TO-252AE-3_V20PW45C_1-6; Footprint Path: Y:\MIS_DATABASE\Library\ALTIUM_TOOL\PCB_FOOTPRINTS\Altium_Footprint_Lib.PcbLib; Library Path: Y:\MIS_DATABASE\Library\ALTIUM_TOOL\SCHEMATICS_PARTS\MS_DISCRETE_Library.schlib; MECHANICAL 3D STEP FILE: TO-252AE-3_V20PW45C_1-6; Chkd/date: MANIRAJA/190419; Crtd /date: MANIRAJA/190419; Datasheet: Y:\MIS_DATABASE\DATASHEETS\DISCRETES\DIODES\V20PW45C.PDF; Temperature: -40°C+150°C; Weight: NA; Height: 1.60MM; Library Ref: DIODE_V20PW45C; Distributor_part_number: V20PW45C-M3/IGICT-ND; Distributor_name: DIGIKEY; Package: TO-252AE-3; Voltage: NA; Tolerance: NA; Mfr_part_number: V20PW45C-M3/I; Footprint Ref: TO-252AE-3_V20PW45C_1-6
D31 = DIODE_TVS_DUAL: DIODE TVS BI-DIR 1500W 58V SMC; Part Reference: D31; Mfr_name: LITTELFUSE; Part_type: DIODE\TVS; Mistral Part No: 130022020036-R; Custom_Duty: 15%; Customs_HS_Code: 85412900; Wattage: NA; Project: TI_J7AHP_EVM_BRD; Value: SMCJ58CA; PCB Footprint: DIO_SMC_2-7; Footprint Path: Y:\MIS_DATABASE\Library\ALTIUM_TOOL\PCB_FOOTPRINTS\Altium_Footprint_Lib.PcbLib; Library Path: Y:\MIS_DATABASE\Library\ALTIUM_TOOL\SCHEMATICS_PARTS\MS_DISCRETE_Library.schlib; MECHANICAL 3D STEP FILE: DIO_SMC_2-7; Chkd/date: ALVY/210222; Crtd /date: TAMILARASU/210222; Datasheet: Y:\MIS_DATABASE\DATASHEETS\DISCRETES\DIODES\LF-SMCJ-SER.PDF; Temperature: -65°C+150°C; Weight: 210mg; Height: 2.62MM; Library Ref: DIODE_TVS_DUAL; Distributor_part_number: SMCJ58CALFCT-ND; Distributor_name: DIGIKEY; Package: SMC; Voltage: 58V; Tolerance: NA; Mfr_part_number: SMCJ58CA; Manufacturer: LITTELFUSE; Footprint Ref: DIO_SMC_2-7
D32 = DIODE_TVS_DUAL: DIODE 1CH ESD PROTECTION FOR USB TYPE-C AND THUNDERBOLT3 X2SON2; Part Reference: D32; Mistral Part No: 130020090037-R; Mfr_name: TEXAS INSTRUMENTS; Part_type: DIODE\TVS; Project: AM64X_SKEVM; Tolerance: NA; Customs_HS_Code: 85412900; Custom_Duty: 15%; Value: TPD1E01B04DPLT; Footprint Ref: DIO_DFN0201_0-4; Mfr_part_number: TPD1E01B04DPLT; Voltage: NA; Wattage: NA; Package: X2SON2; Distributor_name: DIGIKEY; Distributor_part_number: 296-44484-1-ND; Library Ref: DIODE_TVS_DUAL; Height: 0.32MM; Weight: 0.2mg; Temperature: -40°C+125°C; Datasheet: Y:\MIS_DATABASE\DATASHEETS\DISCRETES\DIODES\TPD1E01B04.PDF; Crtd /date: ALVY/230920; Chkd/date: MANIRAJA/230920; MECHANICAL 3D STEP FILE: DIO_DFN0201_0-4; Library Path: Y:\MIS_DATABASE\Library\ALTIUM_TOOL\SCHEMATICS_PARTS\MS_DISCRETE_Library.schlib; Footprint Path: Y:\MIS_DATABASE\Library\ALTIUM_TOOL\PCB_FOOTPRINTS\Altium_Footprint_Lib.PcbLib; PCB Footprint: DIO_DFN0201_0-4
D33 = DIODE_TVS_DUAL: DIODE 1CH ESD PROTECTION FOR USB TYPE-C AND THUNDERBOLT3 X2SON2; Part Reference: D33; Mistral Part No: 130020090037-R; Mfr_name: TEXAS INSTRUMENTS; Part_type: DIODE\TVS; Project: AM64X_SKEVM; Tolerance: NA; Customs_HS_Code: 85412900; Custom_Duty: 15%; Value: TPD1E01B04DPLT; Footprint Ref: DIO_DFN0201_0-4; Mfr_part_number: TPD1E01B04DPLT; Voltage: NA; Wattage: NA; Package: X2SON2; Distributor_name: DIGIKEY; Distributor_part_number: 296-44484-1-ND; Library Ref: DIODE_TVS_DUAL; Height: 0.32MM; Weight: 0.2mg; Temperature: -40°C+125°C; Datasheet: Y:\MIS_DATABASE\DATASHEETS\DISCRETES\DIODES\TPD1E01B04.PDF; Crtd /date: ALVY/230920; Chkd/date: MANIRAJA/230920; MECHANICAL 3D STEP FILE: DIO_DFN0201_0-4; Library Path: Y:\MIS_DATABASE\Library\ALTIUM_TOOL\SCHEMATICS_PARTS\MS_DISCRETE_Library.schlib; Footprint Path: Y:\MIS_DATABASE\Library\ALTIUM_TOOL\PCB_FOOTPRINTS\Altium_Footprint_Lib.PcbLib; PCB Footprint: DIO_DFN0201_0-4
D34 = DIODE_ESD122DMXR: DIODE 2-CH ESD PROTECTION FOR USB TYPE-C AND HDMI 2.0 X2SON-3; Part Reference: D34; Mistral Part No: 130017080015-R; Mfr_name: TEXAS INSTRUMENTS; Part_type: DIODE\TVS; Project: TI_SVB_CONTROLLER CARD; Tolerance: NA; Customs_HS_Code: 85412900; Custom_Duty: 15%; Value: ESD122DMXR; PCB Footprint: X2SON3_ESD122DMX_30X40_0-4; Mfr_part_number: ESD122DMXR; Voltage: NA; Wattage: NA; Package: X2SON-3; Distributor_name: DIGIKEY; Distributor_part_number: ESD122DMXR-ND; Library Ref: DIODE_ESD122DMXR; Height: 0.40MM; Weight: NA; Temperature: -40°C+125°C; Datasheet: Y:\MIS_DATABASE\DATASHEETS\DISCRETES\DIODES\ESD122XX.PDF; Crtd /date: MANIRAJA/140817; Chkd/date: MANIRAJA/140817; MECHANICAL 3D STEP FILE: X2SON3_ESD122DMX_30X40_0-4
F1 = FUSE_HOLDER_0154: FUSE AND HOLDER BLOK 10A SMD; Part Reference: F1; Mistral Part No: 130019020003-R; Mfr_name: LITTLE FUSE; Mfr_part_number: 0154010.DR; Project: TI_J7ES_EVM_CP; Tolerance: NA; Value: 10A; PCB Footprint: FUSEH_154004_380X200_SMD_3-9; Footprint Ref: FUSEH_154004_380X200_SMD_3-9; Part_type: FUSE; Voltage: NA; Wattage: NA; Package: SMD; Distributor_name: DIGIKEY; Distributor_part_number: F1251CT-ND; Library Ref: FUSE_HOLDER_0154; Height: 3.81MM; Weight: NA; Temperature: -55°C+125°C; Datasheet: Y:\MIS_DATABASE\DATASHEETS\MISC\FUSE\0154X-SER.PDF; Crtd /date: MANIRAJA/120219; Chkd/date: MANIRAJA/120219; Customs_HS_Code: NA; Custom_Duty: NA; MECHANICAL 3D STEP FILE: FUSEH_154004_380X200_SMD_3-9; Library Path: Y:\MIS_DATABASE\Library\ALTIUM_TOOL\SCHEMATICS_PARTS\MS_DISCRETE_Library.schlib; Footprint Path: Y:\MIS_DATABASE\Library\ALTIUM_TOOL\PCB_FOOTPRINTS\Altium_Footprint_Lib.PcbLib
F2 = FUSE: PTC RESETTABLE 0.25A 24V 1206; Part Reference: F2; Mfr_part_number: 0ZCJ0025AF2E; Mfr_name: BEL; Mistral Part No: 130022080051-R; Wattage: NA; Project: J7ES_EVM_FUSION2_BRD; Value: 0.25A; PCB Footprint: FUSE_1206_0-8; Chkd/date: PRAVEEN/160822; Crtd /date: PRAVEEN/160822; Datasheet: Y:\MIS_DATABASE\DATASHEETS\MISC\FUSE\0ZCJ0025AF2E.PDF; Temperature: -40°C+85°C; Weight: NA; Height: 0.75MM; Library Ref: FUSE; Distributor_part_number: 507-1799-1-ND; Distributor_name: DIGIKEY; Package: 1206; Voltage: 24V; Tolerance: NA; Part_type: FUSE; Footprint Ref: FUSE_1206_0-8
J21 = CON_TRBLK_2X1: CON TERMINAL BLOCKS 1X2 3.81MM PITCH MALE RT TH; Part Reference: J21; Part_type: CONNECTOR\TERMINAL BLOCK; Mfr_part_number: 1803277; Mfr_name: PHOENIX; Mistral Part No: 150022030013-R; Custom_Duty: 24%; Customs_HS_Code: 85369090; Wattage: NA; Project: TI_J7AHP_EVM_BRD; Value: CON_TRBLK_1X2; PCB Footprint: CON_TB1X2_1803277_P_R_T_7-3; Footprint Path: Y:\MIS_DATABASE\Library\ALTIUM_TOOL\PCB_FOOTPRINTS\Altium_Footprint_Lib.PcbLib; Library Path: Y:\MIS_DATABASE\Library\ALTIUM_TOOL\SCHEMATICS_PARTS\MS_CONNECTOR_Library.schlib; MECHANICAL 3D STEP FILE: CON_TB1X2_1803277_P_R_T_7-3; Chkd/date: ALVY/140322; Crtd /date: TAMILARASU/110322; Datasheet: Y:\MIS_DATABASE\DATASHEETS\CONNECTORS\1803277.PDF; Temperature: NA; Weight: 784mg; Height: 7.25MM; Library Ref: CON_TRBLK_2X1; Distributor_part_number: 277-1206-ND; Distributor_name: DIGIKEY; Package: THRU-HOLE; Voltage: NA; Tolerance: NA; Footprint Ref: CON_TB1X2_1803277_P_R_T_7-3
J22 = HEADER_3X1: CON HDR 1X3 2.00MM PITCH ST TH; Part Reference: J22; Part_type: CONNECTOR\HEADERS; Mfr_part_number: 440054-3; Mfr_name: TE CONNECTIVITY; Mistral Part No: 150017100038-R; Custom_Duty: 24%; Customs_HS_Code: 85369090; Wattage: NA; Project: TI_MAXIE_CPB; Value: HDR_1X3; PCB Footprint: HDR_1X3_440054-3_S_T_6-4; MECHANICAL 3D STEP FILE: HDR_1X3_440054-3_S_T_6-4; Chkd/date: MANIRAJA/261017; Crtd /date: MANIRAJA/261017; Datasheet: Y:\MIS_DATABASE\DATASHEETS\CONNECTORS\440054XXX.PDF; Temperature: -25°C+85°C; Weight: NA; Height: 6.35MM; Library Ref: HEADER_3X1; Distributor_part_number: A100035-ND; Distributor_name: DIGIKEY; Package: THRU-HOLE; Voltage: NA; Tolerance: NA; Manufacturer: TE CONNECTIVITY
J24 = CON_USB-C_24_6327233: CON USB-C TYPE 24POS FEMALE RT SMD; Part Reference: J24; Mistral Part No: 150017080002-R; Mfr_name: WURTH ELECTRONICS; Part_type: CONNECTOR\USB; Project: SD820_NANO_SOM; Tolerance: NA; Customs_HS_Code: 85369090; Custom_Duty: 24%; Value: CON_USB-C_24_F; Voltage: NA; Wattage: NA; Package: SMD; Distributor_name: DIGIKEY; Distributor_part_number: 732-9618-1-ND; Library Ref: CON_USB-C_24_6327233; Height: 3.06MM; Weight: NA; Temperature: -25°C+105°C; Datasheet: Y:\MIS_DATABASE\DATASHEETS\CONNECTORS\632723300011.PDF; Crtd /date: MANIRAJA/020817; Chkd/date: MANIRAJA/020817; MECHANICAL 3D STEP FILE: CON_USBC24_6327233_S_R_S_3-1; PCB Footprint: CON_USBC24_6327233_S_R_S_3-1
J28 = HEADER_3X1: CON HDR 1X3 2.54MM PITCH ST TH; Part Reference: J28; Mistral Part No: 150015100037-R; Mfr_name: WURTH ELECTRONICS INC; Mfr_part_number: 61300311121; Part_type: CONNECTOR\HEADERS; Project: CYPHY_ROADKILL; Tolerance: NA; Customs_HS_Code: 85369090; Custom_Duty: 24%; Value: HDR_1X3; PCB Footprint: HDR_1X3_100_S_T; Voltage: NA; Wattage: NA; Package: THRU-HOLE; Distributor_name: DIGIKEY; Distributor_part_number: 732-5316-ND; Library Ref: HEADER_3X1; Height: 8.54MM; Weight: NA; Temperature: NA; Datasheet: Y:\MIS_DATABASE\DATASHEETS\CONNECTORS\6130XXX.PDF; Crtd /date: VASANTHA/211015; Chkd/date: VASANTHA/211015
L29 = INDUCTOR_DLW31S: IND COMMON MODE CHOKE 90E 280mA SMD; Part Reference: L29; Mfr_part_number: DLW21SZ900HQ2B; Mfr_name: MURATA; Mistral Part No: 130019060035-R; Custom_Duty: 24%; Customs_HS_Code: 85437099; Wattage: NA; Project: TI_J7ES_CP; SIGNAL_MODEL: INDUCTOR_DLW31S_IND4_DLW21H_90X_90E; Value: 90E; PCB Footprint: IND4_DLW21H_90X60_SMD_1-4; MECHANICAL 3D STEP FILE: IND4_DLW21H_90X60_SMD_1-4; Chkd/date: MANIRAJA/270619; Crtd /date: MANIRAJA/270619; Datasheet: Y:\MIS_DATABASE\DATASHEETS\DISCRETES\INDUCTORS\DLW21SZ900HQ2B.PDF; Temperature: -40°C+105°C; Weight: 11mg; Height: 1.40MM; Distributor_part_number: NA; Distributor_name: NA; Package: SMD; Voltage: NA; Tolerance: NA; Part_type: INDUCTOR
R228 = RESISTOR_Dup2: RES 3.48E 1/16W 1% 0402; Part Reference: R228; Mistral Part No: 110021020019-R; Mfr_name: VISHAY; Mfr_part_number: CRCW04023R48FKED; Part_type: RESISTORS\FIXED; Project: TI_DRA821 SK EVM BRD; Voltage: NA; Customs_HS_Code: 85332119; Custom_Duty: 15%; Value: 3.48E_1%; Footprint Ref: RES0402_0-5; Tolerance: 1%; Wattage: 1/16W; Package: 0402; Distributor_name: DIGIKEY; Distributor_part_number: 541-3.48LLCT-ND; Library Ref: RESISTOR; Height: 0.40MM; Weight: 0.65mg; Temperature: -55°C+155°C; Datasheet: Y:\MIS_DATABASE\DATASHEETS\RESISTORS\CRCW0603.PDF; Crtd /date: ALVY/240221; Chkd/date: MANIRAJA/250221; MECHANICAL 3D STEP FILE: RES0402_0-5; Library Path: Y:\MIS_DATABASE\Library\ALTIUM_TOOL\SCHEMATICS_PARTS\MS_DISCRETE_Library.schlib; Footprint Path: Y:\MIS_DATABASE\Library\ALTIUM_TOOL\PCB_FOOTPRINTS\Altium_Footprint_Lib.PcbLib; PCB Footprint: RES0402_0-5
R230 = RESISTOR_Dup2: RES 10K 1/20W 5% 0201; Part Reference: R230; Mistral Part No: 110010070051-R; Mfr_name: YAGEO AMERICA; Mfr_part_number: RC0201JR-0710KL; Part_type: RESISTORS\FIXED; Project: GOLDEN-I LITE; Voltage: NA; Customs_HS_Code: 85332119; Custom_Duty: 15%; Value: 10K; PCB Footprint: RES0201_0-5; Tolerance: 5%; Wattage: 1/20W; Distributor_name: DIGIKEY; Distributor_part_number: 311-10KNCT-ND; Library Ref: RESISTOR; Height: 0.26MM; Weight: 0.17mg; Temperature: -55°C+125°C; Datasheet: Y:\MIS_DATABASE\DATASHEETS\RESISTORS\RCXXXXL-SER_MAR18.PDF; Crtd /date: MANIRAJA/050517; Chkd/date: MANIRAJA/050517; MECHANICAL 3D STEP FILE: RES0201_0-5; Footprint Ref: RES0201_0-5; Library Path: Y:\MIS_DATABASE\Library\ALTIUM_TOOL\SCHEMATICS_PARTS\MS_DISCRETE_Library.schlib; Footprint Path: Y:\MIS_DATABASE\Library\ALTIUM_TOOL\PCB_FOOTPRINTS\Altium_Footprint_Lib.PcbLib
R231 = RESISTOR_Dup2: RES 10K 1/16W 5% 0402; Part Reference: R231; Mistral Part No: 110011060021-R; Mfr_name: YAGEO AMERICA; Mfr_part_number: RC0402JR-0710KL; Part_type: RESISTORS\FIXED; Project: HSE; Voltage: NA; Customs_HS_Code: 85332119; Custom_Duty: 15%; Value: 10K; Footprint Ref: RES0402_0-5; Tolerance: 5%; Wattage: 1/16W; Package: 0402; Distributor_name: DIGIKEY; Distributor_part_number: 311-10KJRCT-ND; Library Ref: RESISTOR; Height: 0.40MM; Weight: 0.65mg; Temperature: -55°C+155°C; Datasheet: Y:\MIS_DATABASE\DATASHEETS\RESISTORS\RCXXXXL-SER_MAR18.PDF; Crtd /date: MAZHAR/230805; Chkd/date: VASANTHA/061216; MECHANICAL 3D STEP FILE: RES0402_0-5; Library Path: Y:\MIS_DATABASE\Library\ALTIUM_TOOL\SCHEMATICS_PARTS\MS_DISCRETE_Library.schlib; Footprint Path: Y:\MIS_DATABASE\Library\ALTIUM_TOOL\PCB_FOOTPRINTS\Altium_Footprint_Lib.PcbLib; PCB Footprint: RES0402_0-5
R232 = RESISTOR_Dup2: RES 0E 1/10W JUMPER 0402; Part Reference: R232; Mistral Part No: 110018030052-R; Mfr_name: PANASONIC-ECG; Mfr_part_number: ERJ-2GE0R00X; Part_type: RESISTORS\FIXED; Project: AEGIS POM; Tolerance: NA; Customs_HS_Code: 85332119; Custom_Duty: 15%; Value: 0E; Footprint Path: Y:\MIS_DATABASE\Library\ALTIUM_TOOL\PCB_FOOTPRINTS\Altium_Footprint_Lib.PcbLib; Library Path: Y:\MIS_DATABASE\Library\ALTIUM_TOOL\SCHEMATICS_PARTS\MS_DISCRETE_Library.schlib; Voltage: NA; Wattage: 1/10W; Package: 0402; Distributor_name: DIGIKEY; Distributor_part_number: P0.0JCT-ND; Height: 0.40MM; Weight: 0.8mg; Temperature: -55°C+155°C; Datasheet: Y:\MIS_DATABASE\DATASHEETS\RESISTORS\PAN-ERJSER_NOV17.PDF; Crtd /date: NAVEED/201014; Chkd/date: VASANTHA/061216; MECHANICAL 3D STEP FILE: RES0402_0-5; Library Ref: RESISTOR; Footprint Ref: RES0402_0-5; PCB Footprint: RES0402_0-5
R233 = RESISTOR_Dup2: RES 0E 1/10W JUMPER 0402; Part Reference: R233; Part_type: RESISTORS\FIXED; Mfr_part_number: ERJ-2GE0R00X; Mfr_name: PANASONIC-ECG; Mistral Part No: 110018030052-R; Custom_Duty: 15%; Customs_HS_Code: 85332119; Voltage: NA; Project: AEGIS POM; Value: 0E; Footprint Ref: RES0402_0-5; Library Ref: RESISTOR; MECHANICAL 3D STEP FILE: RES0402_0-5; Chkd/date: VASANTHA/061216; Crtd /date: NAVEED/201014; Datasheet: Y:\MIS_DATABASE\DATASHEETS\RESISTORS\PAN-ERJSER_NOV17.PDF; Temperature: -55°C+155°C; Weight: 0.8mg; Height: 0.40MM; Distributor_part_number: P0.0JCT-ND; Distributor_name: DIGIKEY; Package: 0402; Wattage: 1/10W; Tolerance: NA; Library Path: Y:\MIS_DATABASE\Library\ALTIUM_TOOL\SCHEMATICS_PARTS\MS_DISCRETE_Library.schlib; Footprint Path: Y:\MIS_DATABASE\Library\ALTIUM_TOOL\PCB_FOOTPRINTS\Altium_Footprint_Lib.PcbLib; PCB Footprint: RES0402_0-5
R234 = RESISTOR_Dup2: RES 10K 1/20W 5% 0201; Part Reference: R234; Mistral Part No: 110010070051-R; Mfr_name: YAGEO AMERICA; Mfr_part_number: RC0201JR-0710KL; Part_type: RESISTORS\FIXED; Project: GOLDEN-I LITE; Voltage: NA; Customs_HS_Code: 85332119; Custom_Duty: 15%; Value: 10K; PCB Footprint: RES0201_0-5; Tolerance: 5%; Wattage: 1/20W; Distributor_name: DIGIKEY; Distributor_part_number: 311-10KNCT-ND; Library Ref: RESISTOR; Height: 0.26MM; Weight: 0.17mg; Temperature: -55°C+125°C; Datasheet: Y:\MIS_DATABASE\DATASHEETS\RESISTORS\RCXXXXL-SER_MAR18.PDF; Crtd /date: MANIRAJA/050517; Chkd/date: MANIRAJA/050517; MECHANICAL 3D STEP FILE: RES0201_0-5; Footprint Ref: RES0201_0-5; Library Path: Y:\MIS_DATABASE\Library\ALTIUM_TOOL\SCHEMATICS_PARTS\MS_DISCRETE_Library.schlib; Footprint Path: Y:\MIS_DATABASE\Library\ALTIUM_TOOL\PCB_FOOTPRINTS\Altium_Footprint_Lib.PcbLib
R237 = RESISTOR_Dup2: RES 100K 1/10W 5% 0402; Part Reference: R237; Part_type: RESISTORS\FIXED; Mfr_part_number: ERJ-2GEJ104X; Mfr_name: PANASONIC-ECG; Mistral Part No: 110009030177-R; Custom_Duty: 15%; Customs_HS_Code: 85332119; Voltage: NA; Project: RED EYE; Value: 100K; PCB Footprint: RES0402_0-5; Footprint Path: Y:\MIS_DATABASE\Library\ALTIUM_TOOL\PCB_FOOTPRINTS\Altium_Footprint_Lib.PcbLib; Library Path: Y:\MIS_DATABASE\Library\ALTIUM_TOOL\SCHEMATICS_PARTS\MS_DISCRETE_Library.schlib; MECHANICAL 3D STEP FILE: RES0402_0-5; Chkd/date: VASANTHA/291216; Crtd /date: GEETHA/190406; Datasheet: Y:\MIS_DATABASE\DATASHEETS\RESISTORS\PAN-ERJSER_NOV17.PDF; Temperature: -55°C+155°C; Weight: 0.8mg; Height: 0.40MM; Library Ref: RESISTOR; Distributor_part_number: P100KJCT-ND; Distributor_name: DIGIKEY; Package: 0402; Wattage: 1/10W; Tolerance: 5%; Footprint Ref: RES0402_0-5
R243 = RESISTOR_Dup2: RES 10K 1/16W 5% 0402; Part Reference: R243; Mistral Part No: 110011060021-R; Mfr_name: YAGEO AMERICA; Mfr_part_number: RC0402JR-0710KL; Part_type: RESISTORS\FIXED; Project: HSE; Voltage: NA; Customs_HS_Code: 85332119; Custom_Duty: 15%; Value: 10K; PCB Footprint: RES0402_0-5; Footprint Ref: RES0402_0-5; Tolerance: 5%; Wattage: 1/16W; Package: 0402; Distributor_name: DIGIKEY; Distributor_part_number: 311-10KJRCT-ND; Library Ref: RESISTOR; Height: 0.40MM; Weight: 0.65mg; Temperature: -55°C+155°C; Datasheet: Y:\MIS_DATABASE\DATASHEETS\RESISTORS\RCXXXXL-SER_MAR18.PDF; Crtd /date: MAZHAR/230805; Chkd/date: VASANTHA/061216; MECHANICAL 3D STEP FILE: RES0402_0-5; Library Path: Y:\MIS_DATABASE\Library\ALTIUM_TOOL\SCHEMATICS_PARTS\MS_DISCRETE_Library.schlib; Footprint Path: Y:\MIS_DATABASE\Library\ALTIUM_TOOL\PCB_FOOTPRINTS\Altium_Footprint_Lib.PcbLib
R246 = RESISTOR_Dup2: RES 10K 1/16W 5% 0402; Part Reference: R246; Mistral Part No: 110011060021-R; Mfr_name: YAGEO AMERICA; Mfr_part_number: RC0402JR-0710KL; Part_type: RESISTORS\FIXED; Project: HSE; Voltage: NA; Customs_HS_Code: 85332119; Custom_Duty: 15%; Value: 10K; PCB Footprint: RES0402_0-5; Footprint Ref: RES0402_0-5; Tolerance: 5%; Wattage: 1/16W; Package: 0402; Distributor_name: DIGIKEY; Distributor_part_number: 311-10KJRCT-ND; Library Ref: RESISTOR; Height: 0.40MM; Weight: 0.65mg; Temperature: -55°C+155°C; Datasheet: Y:\MIS_DATABASE\DATASHEETS\RESISTORS\RCXXXXL-SER_MAR18.PDF; Crtd /date: MAZHAR/230805; Chkd/date: VASANTHA/061216; MECHANICAL 3D STEP FILE: RES0402_0-5; Library Path: Y:\MIS_DATABASE\Library\ALTIUM_TOOL\SCHEMATICS_PARTS\MS_DISCRETE_Library.schlib; Footprint Path: Y:\MIS_DATABASE\Library\ALTIUM_TOOL\PCB_FOOTPRINTS\Altium_Footprint_Lib.PcbLib
R249 = RESISTOR_Dup2: RES 100K 1/10W 5% 0402; Part Reference: R249; Mistral Part No: 110009030177-R; Mfr_name: PANASONIC-ECG; Mfr_part_number: ERJ-2GEJ104X; Part_type: RESISTORS\FIXED; Project: RED EYE; Voltage: NA; Customs_HS_Code: 85332119; Custom_Duty: 15%; Value: 100K; PCB Footprint: RES0402_0-5; Footprint Ref: RES0402_0-5; Tolerance: 5%; Wattage: 1/10W; Package: 0402; Distributor_name: DIGIKEY; Distributor_part_number: P100KJCT-ND; Library Ref: RESISTOR; Height: 0.40MM; Weight: 0.8mg; Temperature: -55°C+155°C; Datasheet: Y:\MIS_DATABASE\DATASHEETS\RESISTORS\PAN-ERJSER_NOV17.PDF; Crtd /date: GEETHA/190406; Chkd/date: VASANTHA/291216; MECHANICAL 3D STEP FILE: RES0402_0-5; Library Path: Y:\MIS_DATABASE\Library\ALTIUM_TOOL\SCHEMATICS_PARTS\MS_DISCRETE_Library.schlib; Footprint Path: Y:\MIS_DATABASE\Library\ALTIUM_TOOL\PCB_FOOTPRINTS\Altium_Footprint_Lib.PcbLib
R259 = RESISTOR_Dup2: RES 0E 1/20W JUMPER 0201; Part Reference: R259; Mistral Part No: 110009030078-R; Mfr_name: PANASONIC-ECG; Mfr_part_number: ERJ-1GN0R00C; Part_type: RESISTORS\FIXED; Project: SRMS-SAR_BRD; Tolerance: NA; Customs_HS_Code: 85332119; Custom_Duty: 15%; SIGNAL_MODEL: RESISTOR_RES0201_0-5_0E_0E; Value: 0E; Footprint Ref: RES0201_0-5; Voltage: NA; Wattage: 1/20W; Distributor_name: DIGIKEY; Distributor_part_number: P15979CT-ND; Library Ref: RESISTOR; Height: 0.26MM; Weight: 0.15mg; Temperature: -55°C+125°C; Datasheet: Y:\MIS_DATABASE\DATASHEETS\RESISTORS\PAN-ERJSER_NOV17.PDF; Crtd /date: ALVY/290421; Chkd/date: MANIRAJA/290421; MECHANICAL 3D STEP FILE: RES0201_0-5; Library Path: Y:\MIS_DATABASE\Library\ALTIUM_TOOL\SCHEMATICS_PARTS\MS_DISCRETE_Library.schlib; Footprint Path: Y:\MIS_DATABASE\Library\ALTIUM_TOOL\PCB_FOOTPRINTS\Altium_Footprint_Lib.PcbLib; PCB Footprint: RES0201_0-5
R260 = RESISTOR_Dup2: RES 0E 1/20W JUMPER 0201; Part Reference: R260; Part_type: RESISTORS\FIXED; Mfr_part_number: ERJ-1GN0R00C; Mfr_name: PANASONIC-ECG; Mistral Part No: 110009030078-R; Custom_Duty: 15%; Customs_HS_Code: 85332119; Voltage: NA; Project: SRMS-SAR_BRD; SIGNAL_MODEL: RESISTOR_RES0201_0-5_0E_0E; Value: 0E; Footprint Path: Y:\MIS_DATABASE\Library\ALTIUM_TOOL\PCB_FOOTPRINTS\Altium_Footprint_Lib.PcbLib; Library Path: Y:\MIS_DATABASE\Library\ALTIUM_TOOL\SCHEMATICS_PARTS\MS_DISCRETE_Library.schlib; MECHANICAL 3D STEP FILE: RES0201_0-5; Chkd/date: MANIRAJA/290421; Crtd /date: ALVY/290421; Datasheet: Y:\MIS_DATABASE\DATASHEETS\RESISTORS\PAN-ERJSER_NOV17.PDF; Temperature: -55°C+125°C; Weight: 0.15mg; Height: 0.26MM; Library Ref: RESISTOR; Distributor_part_number: P15979CT-ND; Distributor_name: DIGIKEY; Wattage: 1/20W; Tolerance: NA; Footprint Ref: RES0201_0-5; PCB Footprint: RES0201_0-5
R267 = RESISTOR_Dup2: RES 0E 1/8W 5% 0805; Part Reference: R267; Part_type: RESISTORS\FIXED; Mfr_part_number: RC0805JR-070RL; Mfr_name: YAGEO AMERICA; Mistral Part No: 110009030074-R; Custom_Duty: 15%; Customs_HS_Code: 85332119; Voltage: NA; Project: ZK_BIOMETRIC; Value: 0E; Footprint Path: Y:\MIS_DATABASE\Library\ALTIUM_TOOL\PCB_FOOTPRINTS\Altium_Footprint_Lib.PcbLib; Library Path: Y:\MIS_DATABASE\Library\ALTIUM_TOOL\SCHEMATICS_PARTS\MS_DISCRETE_Library.schlib; MECHANICAL 3D STEP FILE: RES0805_0-75; Chkd/date: VASANTHA/130416; Crtd /date: JEBRAN/020316; Datasheet: Y:\MIS_DATABASE\DATASHEETS\RESISTORS\RCXXXXL-SER_MAR18.PDF; Temperature: -55°C+155°C; Weight: 5.5mg; Height: 0.60MM; Library Ref: RESISTOR; Distributor_part_number: 311-0.0ARCT-ND; Distributor_name: DIGIKEY; Package: 0805; Wattage: 1/8W; Tolerance: 5%; Footprint Ref: RES0805_0-75; PCB Footprint: RES0805_0-75
R526 = RESISTOR_Dup2: RES 2.2K 1/20W 5% 0201; Part Reference: R526; Part_type: RESISTORS\FIXED; Mfr_part_number: RC0201JR-072K2L; Mfr_name: YAGEO AMERICA; Mistral Part No: 110009030427-R; Custom_Duty: 15%; Customs_HS_Code: 85332119; Voltage: NA; Project: GOLDEN-I LITE; Value: 2.2K; PCB Footprint: RES0201_0-5; Footprint Path: Y:\MIS_DATABASE\Library\ALTIUM_TOOL\PCB_FOOTPRINTS\Altium_Footprint_Lib.PcbLib; Library Path: Y:\MIS_DATABASE\Library\ALTIUM_TOOL\SCHEMATICS_PARTS\MS_DISCRETE_Library.schlib; Footprint Ref: RES0201_0-5; MECHANICAL 3D STEP FILE: RES0201_0-5; Chkd/date: MANIRAJA/050517; Crtd /date: MANIRAJA/050517; Datasheet: Y:\MIS_DATABASE\DATASHEETS\RESISTORS\RCXXXXL-SER_MAR18.PDF; Temperature: -55°C+125°C; Weight: 0.17mg; Height: 0.26MM; Library Ref: RESISTOR; Distributor_part_number: 311-2.2KNCT-ND; Distributor_name: DIGIKEY; Wattage: 1/20W; Tolerance: 5%
R527 = RESISTOR_Dup2: RES 2.2K 1/20W 5% 0201; Part Reference: R527; Part_type: RESISTORS\FIXED; Mfr_part_number: RC0201JR-072K2L; Mfr_name: YAGEO AMERICA; Mistral Part No: 110009030427-R; Custom_Duty: 15%; Customs_HS_Code: 85332119; Voltage: NA; Project: GOLDEN-I LITE; Value: 2.2K; PCB Footprint: RES0201_0-5; Footprint Path: Y:\MIS_DATABASE\Library\ALTIUM_TOOL\PCB_FOOTPRINTS\Altium_Footprint_Lib.PcbLib; Library Path: Y:\MIS_DATABASE\Library\ALTIUM_TOOL\SCHEMATICS_PARTS\MS_DISCRETE_Library.schlib; Footprint Ref: RES0201_0-5; MECHANICAL 3D STEP FILE: RES0201_0-5; Chkd/date: MANIRAJA/050517; Crtd /date: MANIRAJA/050517; Datasheet: Y:\MIS_DATABASE\DATASHEETS\RESISTORS\RCXXXXL-SER_MAR18.PDF; Temperature: -55°C+125°C; Weight: 0.17mg; Height: 0.26MM; Library Ref: RESISTOR; Distributor_part_number: 311-2.2KNCT-ND; Distributor_name: DIGIKEY; Wattage: 1/20W; Tolerance: 5%
TP85 = TESTPOINT_Dup1: TESTPOINT CIR 30 SMD; Part Reference: TP85; Mfr_name: LOCAL; Mistral Part No: 130009030930; MECHANICAL 3D STEP FILE: NA; Project: BT MODULE_CSRBC04; Value: TP30_SMD; Footprint Path: Y:\MIS_DATABASE\Library\ALTIUM_TOOL\PCB_FOOTPRINTS\Altium_Footprint_Lib.PcbLib; Library Path: Y:\MIS_DATABASE\Library\ALTIUM_TOOL\SCHEMATICS_PARTS\MS_DISCRETE_Library.schlib; Custom_Duty: NA; Customs_HS_Code: NA; RoHS: NA; Temperature: NA; Weight: NA; Wattage: NA; Voltage: NA; Tolerance: NA; Footprint Ref: TP30_SMD; Datasheet: NA; Chkd/date: SHREESHAIL/171006; Crtd /date: MAZHAR/171006; Height: NA; Distributor_part_number: NA; Distributor_name: NA; Package: SMD; Part_type: TESTPOINT; Mfr_part_number: TP30_SMD; Library Ref: TESTPOINT; PCB Footprint: TP30_SMD
U52 = TPS25750D_WQFN38: IC USB TYPE-C AND USB PD CONTROLLER WITH INTEGRATED POWER SWITCHES WQFN38; Part Reference: U52; Mistral Part No: 142021020012-R; Mfr_name: TEXAS INSTRUMENTS; Part_type: ICS\POWER\CONTROL; Project: J7ES_SK_BRD; Tolerance: NA; Customs_HS_Code: 85423100; Custom_Duty: 15%; Value: TPS25750DRJKR; Footprint Ref: WQFN38_TPS25750_240X160_0-8; Mfr_part_number: TPS25750DRJKR; Voltage: NA; Wattage: NA; Package: WQFN38; Distributor_name: DIGIKEY; Distributor_part_number: 296-TPS25750DRJKRCT-ND; Library Ref: TPS25750D_WQFN38; Height: 0.80MM; Weight: NA; Temperature: -40°C+125°C; Datasheet: Y:\MIS_DATABASE\DATASHEETS\ICS\POWER\TPS25750X.PDF; Crtd /date: ALVY/080221; Chkd/date: MANIRAJA/080221; MECHANICAL 3D STEP FILE: WQFN38_TPS25750_240X160_0-8; Library Path: Y:\MIS_DATABASE\Library\ALTIUM_TOOL\SCHEMATICS_PARTS\MS_MISCPOWER_Library.schlib; Footprint Path: Y:\MIS_DATABASE\Library\ALTIUM_TOOL\PCB_FOOTPRINTS\Altium_Footprint_Lib.PcbLib; PCB Footprint: WQFN38_TPS25750_240X160_0-8
U54 = TVS2200_WSON6: IC 22V FLAT-CLAMP SURGE PROTECTION DEVICE WSON6; Part Reference: U54; Mistral Part No: 142021100001-R; Mfr_name: TEXAS INSTRUMENTS; Part_type: ICS\POWER; Project: TI_AM62x SKEVM_BRD; Tolerance: NA; Customs_HS_Code: 85423100; Custom_Duty: 15%; Value: TVS2200DRVR; PCB Footprint: SON6_25-59_85X85_0-8; Footprint Ref: SON6_25-59_85X85_0-8; Mfr_part_number: TVS2200DRVR; Voltage: NA; Wattage: NA; Package: WSON6; Distributor_name: DIGIKEY; Distributor_part_number: 296-52187-1-ND; Library Ref: TVS2200_WSON6; Height: 0.80MM; Weight: 12mg; Temperature: -40°C+125°C; Datasheet: Y:\MIS_DATABASE\DATASHEETS\ICS\POWER\TVS2200.PDF; Crtd /date: ALVY/011021; Chkd/date: MANIRAJA/011021; MECHANICAL 3D STEP FILE: SON6_25-59_85X85_0-8; Library Path: Y:\MIS_DATABASE\Library\ALTIUM_TOOL\SCHEMATICS_PARTS\MS_MISCPOWER_Library.schlib; Footprint Path: Y:\MIS_DATABASE\Library\ALTIUM_TOOL\PCB_FOOTPRINTS\Altium_Footprint_Lib.PcbLib
U102 = CAT24C256WI-GT3_SOIC8: IC 256K I2C CMOS SERIAL EEPROM SOIC8; Part Reference: U102; Mistral Part No: 141110050004-R; Mfr_name: ON SEMICONDUCTOR; Part_type: ICS\DIGITAL\MEMORY; Project: CENTAURUS; Tolerance: NA; Customs_HS_Code: 85423100; Custom_Duty: 15%; Value: CAT24C256WI-GT3; PCB Footprint: SOIC8_1-8; Mfr_part_number: CAT24C256WI-GT3; Voltage: NA; Wattage: NA; Package: SOIC8; Distributor_name: DIGIKEY; Distributor_part_number: CAT24C256WI-GT3-ND; Library Ref: CAT24C256WI-GT3_SOIC8; Height: 1.75MM; Weight: 540mg; Temperature: -40°C+85°C; Datasheet: Y:\MIS_DATABASE\DATASHEETS\ICS\MEMORY\CAT24C256WI.PDF; Crtd /date: MUDDU/270510; Chkd/date: MANIRAJA/130617; MECHANICAL 3D STEP FILE: SOIC8_1-8